# Altium schematic sheet Main_uC.SchDoc: Main microcontroller
size A3; Organization: Use Organization_Name in ProjParam; Address1: Eliot Ferragni; Address2: STI-MOBOTS; Address3: EPFL; Address4: CH-1015 LAUSANNE; DocumentNumber: 2; Revision: A; SheetNumber: 2; SheetTotal: 11; ApprovedBy: Init ApprovedBy in DocParam; CheckedBy: Init CheckedBy in DocParam; Author: Init Author in DocParam; CompanyName: Init CompanyName in DocParam; DrawnBy: Init DrawBy in DocParam; Engineer: Init Engineer in DocParam; Title2: Main microcontroller + user's buttons; DocumentName: Init DocumentName in DocParam; ProjectName: Init ProjectName in DocParam
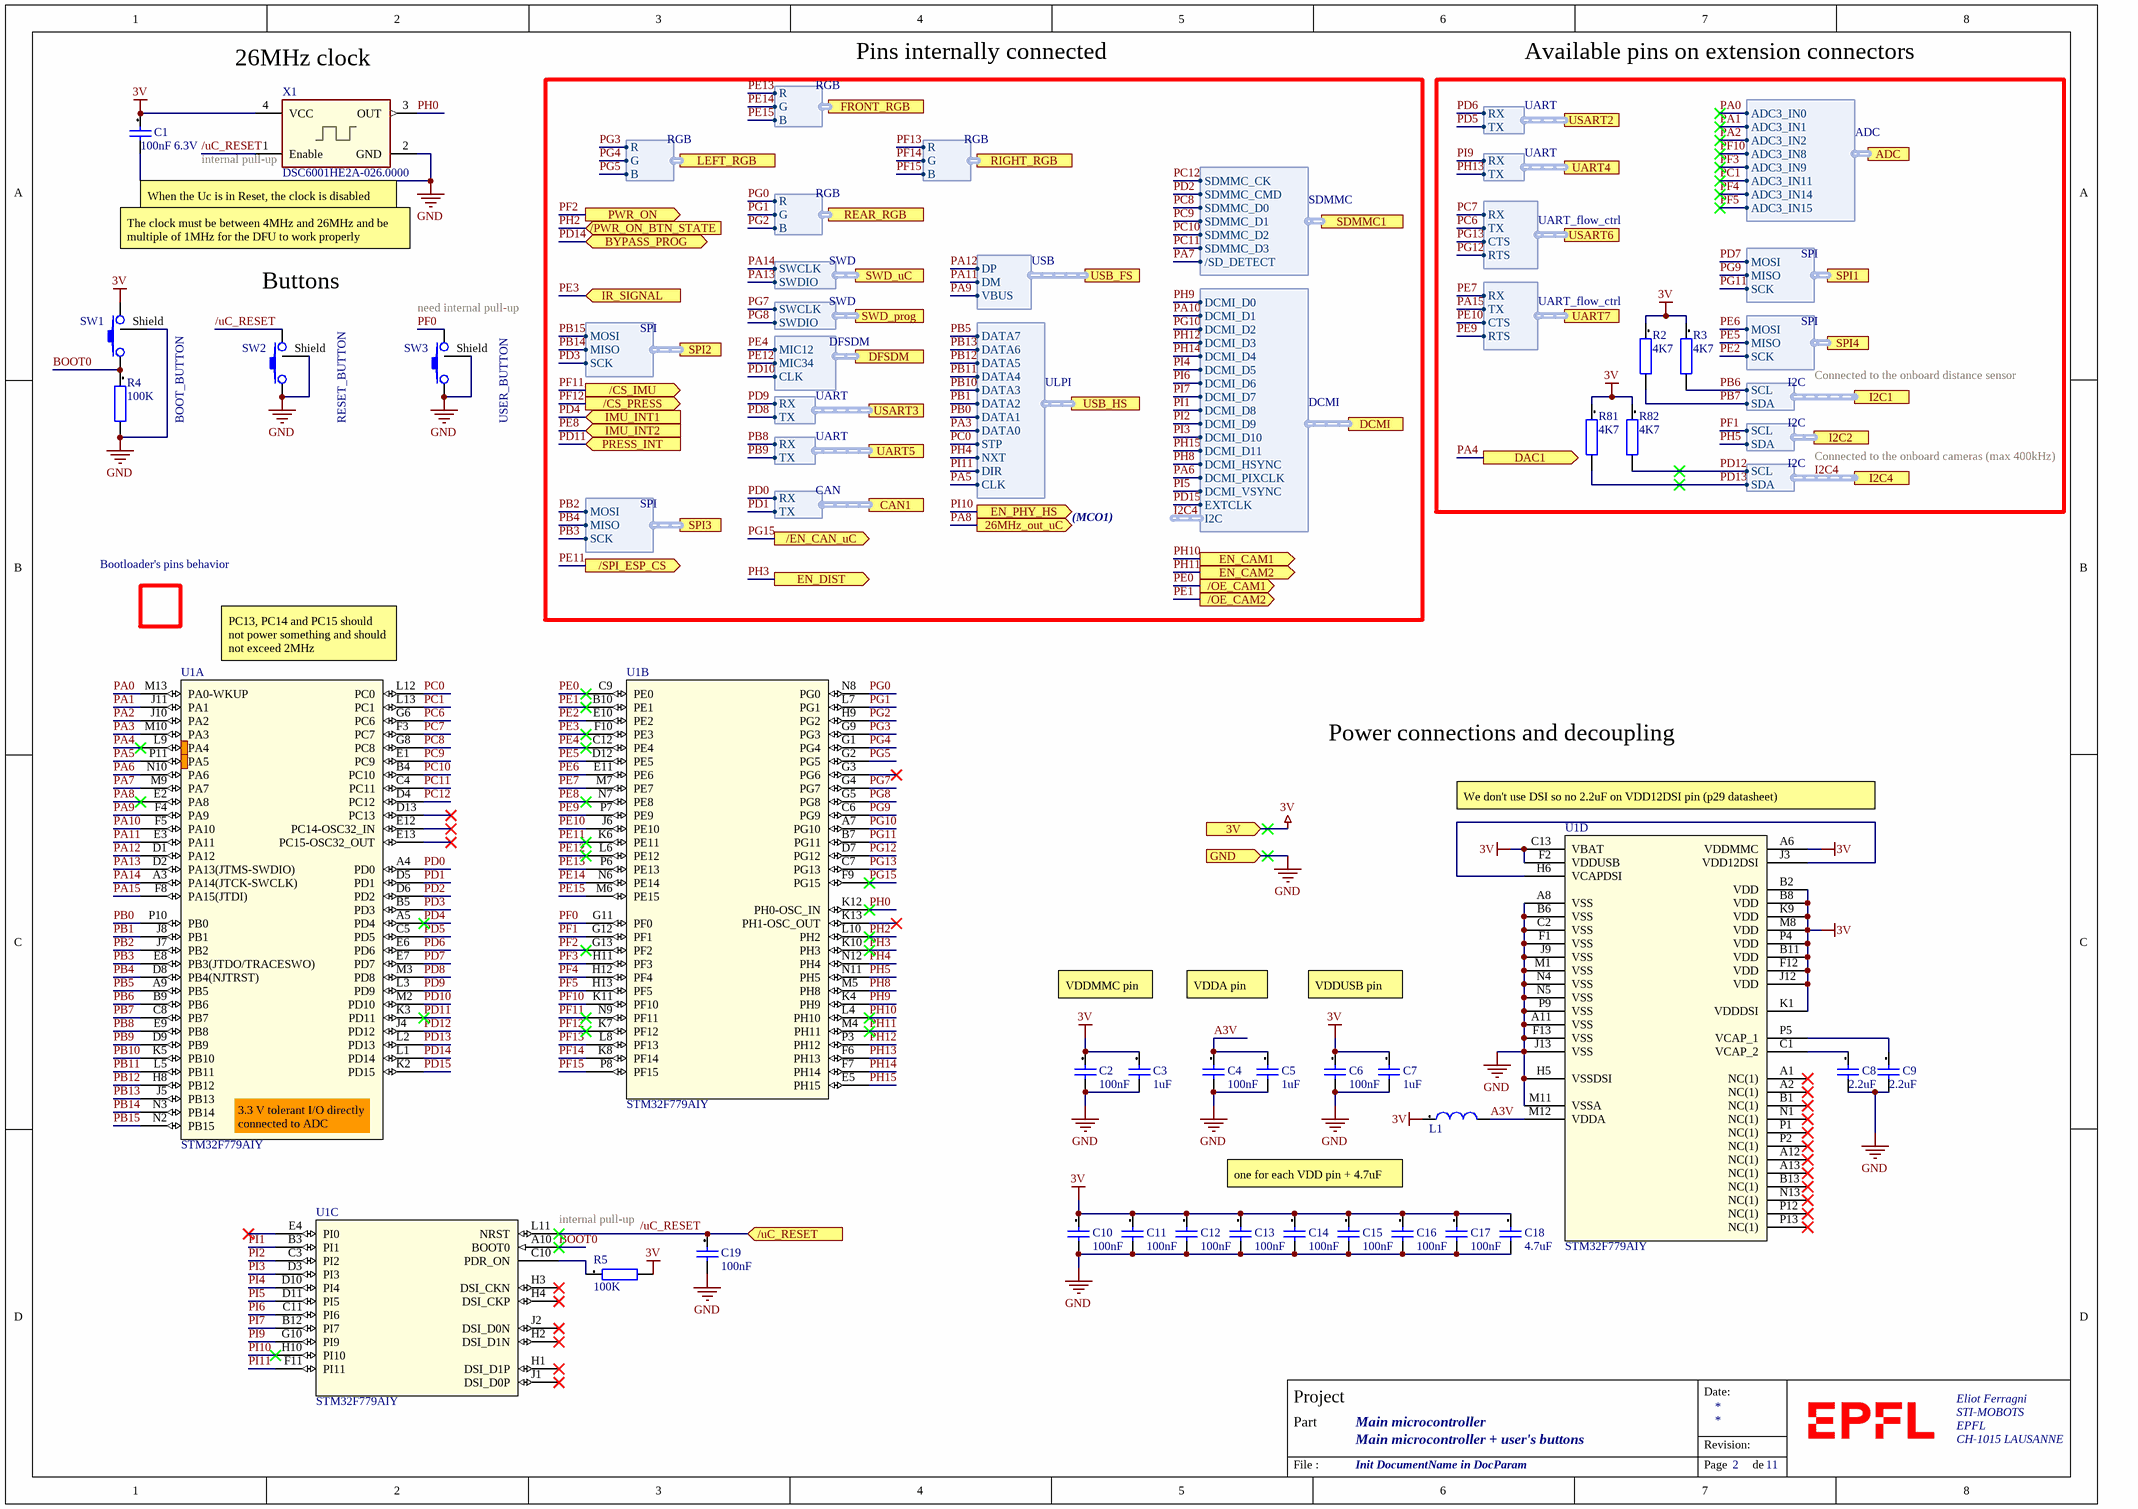
[diagram p0: Main_uC.SchDoc]

## Parts
C1  100nF 6.3V  [CAPC0201(0603)33_L]
C2  100nF  [CAPC0201(0603)33_L]
C3  1uF  [CAPC0201(0603)33_L]
C4  100nF  [CAPC0201(0603)33_L]
C5  1uF  [CAPC0201(0603)33_L]
C6  100nF  [CAPC0201(0603)33_L]
C7  1uF  [CAPC0201(0603)33_L]
C8  2.2uF  [CAPC0201(0603)33_L]
C9  2.2uF  [CAPC0201(0603)33_L]
C10  100nF  [CAPC0201(0603)33_L]
C11  100nF  [CAPC0201(0603)33_L]
C12  100nF  [CAPC0201(0603)33_L]
C13  100nF  [CAPC0201(0603)33_L]
C14  100nF  [CAPC0201(0603)33_L]
C15  100nF  [CAPC0201(0603)33_L]
C16  100nF  [CAPC0201(0603)33_L]
C17  100nF  [CAPC0201(0603)33_L]
C18  4.7uF  [CAPC0201(0603)33_L]
C19  100nF  [CAPC0201(0603)33_L]
L1  MMZ1005S601HT000  [0402 inductor]  (value not drawn)
R2  4K7  [RESC0201(0603)_L]
R3  4K7  [RESC0201(0603)_L]
R4  100K  [RESC0201(0603)_L]
R5  100K  [RESC0201(0603)_L]
R81  4K7  [RESC0201(0603)_L]
R82  4K7  [RESC0201(0603)_L]
SW1  button  [C&K_KMR2]  (value not drawn)
SW2  button  [C&K_KMR2]  (value not drawn)
SW3  button  [C&K_KMR2]  (value not drawn)
U1  STM32F779AIY  [WLCSP-180]  (parts A,B,C,D of 4)
X1  DSC6001HE2A-026.0000  [Oscillator 1.6x1.2mm VFLGA]

## Blocks framed on the sheet
Available pins on extension connectors: R2 R3 R81 R82

## Ports
3V (in), 26MHz_out_uC (out), /CS_IMU (out), /CS_PRESS (out), /EN_CAN_uC (out), /OE_CAM1 (out), /OE_CAM2 (out), /PWR_ON_BTN_STATE (in), /SPI_ESP_CS (out), /uC_RESET (in), ADC (harness ADC), BYPASS_PROG (bidir), CAN1 (harness CAN), DAC1 (out), DCMI (harness DCMI), DFSDM (harness DFSDM), EN_CAM1 (out), EN_CAM2 (out), EN_DIST (out), EN_PHY_HS (out), FRONT_RGB (harness RGB), GND (in), I2C1 (harness I2C), I2C2 (harness I2C), I2C4 (harness I2C), IMU_INT1 (in), IMU_INT2 (in), IR_SIGNAL (in), LEFT_RGB (harness RGB), PRESS_INT (in), PWR_ON (out), REAR_RGB (harness RGB), RIGHT_RGB (harness RGB), SDMMC1 (harness SDMMC), SPI1 (harness SPI), SPI2 (harness SPI), SPI3 (harness SPI), SPI4 (harness SPI), SWD_prog (harness SWD), SWD_uC (harness SWD), UART4 (harness UART), UART5 (harness UART), UART7 (harness UART_flow_ctrl), USART2 (harness UART), USART3 (harness UART), USART6 (harness UART_flow_ctrl), USB_FS (harness USB), USB_HS (harness ULPI)

## Harnesses
SWD: SWDIO, SWCLK
I2C: SDA, SCL
CAN: TX, RX
USB: DM, DP, VBUS
UART: RX, TX
RGB: R, G, B
DFSDM: MIC34, MIC12, CLK
DCMI: DCMI_D0, DCMI_D1, DCMI_D2, DCMI_D3, DCMI_D4, DCMI_D5, DCMI_D6, DCMI_D7, DCMI_D8, DCMI_D9, DCMI_D10, DCMI_D11, DCMI_HSYNC, DCMI_PIXCLK, DCMI_VSYNC, I2C, EXTCLK
SDMMC: SDMMC_CK, SDMMC_CMD, SDMMC_D0, SDMMC_D1, SDMMC_D2, SDMMC_D3, /SD_DETECT
SPI: MISO, MOSI, SCK
UART_flow_ctrl: RX, TX, CTS, RTS
ADC: ADC3_IN0, ADC3_IN1, ADC3_IN2, ADC3_IN8, ADC3_IN9, ADC3_IN11, ADC3_IN14, ADC3_IN15
ULPI: DATA7, DATA6, DATA5, DATA4, DATA3, DATA2, DATA1, DATA0, STP, NXT, DIR, CLK

## Nets
3V: C1.1 C2.1 C3.1 C6.1 C7.1 C10.1 C11.1 C12.1 C13.1 C14.1 C15.1 C16.1 C17.1 C18.1 L1.1 R2.1 R3.1 R5.2 R81.1 R82.1 SW1.2 U1.A6(VDDMMC) U1.B2(VDD) U1.B8(VDD) U1.B11(VDD) U1.C13(VBAT) U1.F2(VDDUSB) U1.F12(VDD) U1.J12(VDD) U1.K1(VDDDSI) U1.K9(VDD) U1.M8(VDD) U1.P4(VDD) X1.4(VCC) ; port 3V
GND: C1.2 C2.2 C3.2 C4.2 C5.2 C6.2 C7.2 C8.2 C9.2 C10.2 C11.2 C12.2 C13.2 C14.2 C15.2 C16.2 C17.2 C18.2 C19.2 R4.2 SW1.Shield SW2.1 SW2.Shield SW3.1 SW3.Shield U1.A8(VSS) U1.A11(VSS) U1.B6(VSS) U1.C2(VSS) U1.F1(VSS) U1.F13(VSS) U1.H5(VSSDSI) U1.J9(VSS) U1.J13(VSS) U1.M1(VSS) U1.M11(VSSA) U1.N4(VSS) U1.N5(VSS) U1.P9(VSS) X1.2(GND) ; port GND
/uC_RESET: C19.1 SW2.2 U1.L11(NRST) X1.1(Enable) ; port /uC_RESET
A3V: C4.1 C5.1 L1.2 U1.M12(VDDA)
BOOT0: R4.1 SW1.1 U1.A10(BOOT0)
PA0: U1.M13(PA0-WKUP) ; port ADC.ADC3_IN0
PA1: U1.J11(PA1) ; port ADC.ADC3_IN1
PA2: U1.J10(PA2) ; port ADC.ADC3_IN2
PA3: U1.M10(PA3) ; port USB_HS.DATA0
PA4: U1.L9(PA4) ; port DAC1
PA5: U1.P11(PA5) ; port USB_HS.CLK
PA6: U1.N10(PA6) ; port DCMI.DCMI_PIXCLK
PA7: U1.M9(PA7) ; port SDMMC1./SD_DETECT
PA8: U1.E2(PA8) ; port 26MHz_out_uC
PA9: U1.F4(PA9) ; port USB_FS.VBUS
PA10: U1.F5(PA10) ; port DCMI.DCMI_D1
PA11: U1.E3(PA11) ; port USB_FS.DM
PA12: U1.D1(PA12) ; port USB_FS.DP
PA13: U1.D2(PA13(JTMS-SWDIO)) ; port SWD_uC.SWDIO
PA14: U1.A3(PA14(JTCK-SWCLK)) ; port SWD_uC.SWCLK
PA15: U1.F8(PA15(JTDI)) ; port UART7.TX
PB0: U1.P10(PB0) ; port USB_HS.DATA1
PB1: U1.J8(PB1) ; port USB_HS.DATA2
PB2: U1.J7(PB2) ; port SPI3.MOSI
PB3: U1.E8(PB3(JTDO/TRACESWO)) ; port SPI3.SCK
PB4: U1.D8(PB4(NJTRST)) ; port SPI3.MISO
PB5: U1.A9(PB5) ; port USB_HS.DATA7
PB6: R3.2 U1.B9(PB6) ; port I2C1.SCL
PB7: R2.2 U1.C8(PB7) ; port I2C1.SDA
PB8: U1.E9(PB8) ; port UART5.RX
PB9: U1.D9(PB9) ; port UART5.TX
PB10: U1.K5(PB10) ; port USB_HS.DATA3
PB11: U1.L5(PB11) ; port USB_HS.DATA4
PB12: U1.H8(PB12) ; port USB_HS.DATA5
PB13: U1.J5(PB13) ; port USB_HS.DATA6
PB14: U1.N3(PB14) ; port SPI2.MISO
PB15: U1.N2(PB15) ; port SPI2.MOSI
PC0: U1.L12(PC0) ; port USB_HS.STP
PC1: U1.L13(PC1) ; port ADC.ADC3_IN11
PC6: U1.G6(PC6) ; port USART6.TX
PC7: U1.F3(PC7) ; port USART6.RX
PC8: U1.G8(PC8) ; port SDMMC1.SDMMC_D0
PC9: U1.E1(PC9) ; port SDMMC1.SDMMC_D1
PC10: U1.B4(PC10) ; port SDMMC1.SDMMC_D2
PC11: U1.C4(PC11) ; port SDMMC1.SDMMC_D3
PC12: U1.D4(PC12) ; port SDMMC1.SDMMC_CK
PD0: U1.A4(PD0) ; port CAN1.RX
PD1: U1.D5(PD1) ; port CAN1.TX
PD2: U1.D6(PD2) ; port SDMMC1.SDMMC_CMD
PD3: U1.B5(PD3) ; port SPI2.SCK
PD4: U1.A5(PD4) ; port IMU_INT1
PD5: U1.C5(PD5) ; port USART2.TX
PD6: U1.E6(PD6) ; port USART2.RX
PD7: U1.E7(PD7) ; port SPI1.MOSI
PD8: U1.M3(PD8) ; port USART3.TX
PD9: U1.L3(PD9) ; port USART3.RX
PD10: U1.M2(PD10) ; port DFSDM.CLK
PD11: U1.K3(PD11) ; port PRESS_INT
PD12: R82.2 U1.J4(PD12) ; port I2C4.SCL  [project net I2C4.SCL]
PD13: R81.2 U1.L2(PD13) ; port I2C4.SDA  [project net I2C4.SDA]
PD14: U1.L1(PD14) ; port BYPASS_PROG
PD15: U1.K2(PD15) ; port DCMI.EXTCLK
PE0: U1.C9(PE0) ; port /OE_CAM1
PE1: U1.B10(PE1) ; port /OE_CAM2
PE2: U1.E10(PE2) ; port SPI4.SCK
PE3: U1.F10(PE3) ; port IR_SIGNAL
PE4: U1.C12(PE4) ; port DFSDM.MIC12
PE5: U1.D12(PE5) ; port SPI4.MISO
PE6: U1.E11(PE6) ; port SPI4.MOSI
PE7: U1.M7(PE7) ; port UART7.RX
PE8: U1.N7(PE8) ; port IMU_INT2
PE9: U1.P7(PE9) ; port UART7.RTS
PE10: U1.J6(PE10) ; port UART7.CTS
PE11: U1.K6(PE11) ; port /SPI_ESP_CS
PE12: U1.L6(PE12) ; port DFSDM.MIC34
PE13: U1.P6(PE13) ; port FRONT_RGB.R
PE14: U1.N6(PE14) ; port FRONT_RGB.G
PE15: U1.M6(PE15) ; port FRONT_RGB.B
PF0: SW3.2 U1.G11(PF0)
PF1: U1.G12(PF1) ; port I2C2.SCL
PF2: U1.G13(PF2) ; port PWR_ON
PF3: U1.H11(PF3) ; port ADC.ADC3_IN9
PF4: U1.H12(PF4) ; port ADC.ADC3_IN14
PF5: U1.H13(PF5) ; port ADC.ADC3_IN15
PF10: U1.K11(PF10) ; port ADC.ADC3_IN8
PF11: U1.N9(PF11) ; port /CS_IMU
PF12: U1.K7(PF12) ; port /CS_PRESS
PF13: U1.L8(PF13) ; port RIGHT_RGB.R
PF14: U1.K8(PF14) ; port RIGHT_RGB.G
PF15: U1.P8(PF15) ; port RIGHT_RGB.B
PG0: U1.N8(PG0) ; port REAR_RGB.R
PG1: U1.L7(PG1) ; port REAR_RGB.G
PG2: U1.H9(PG2) ; port REAR_RGB.B
PG3: U1.G9(PG3) ; port LEFT_RGB.R
PG4: U1.G1(PG4) ; port LEFT_RGB.G
PG5: U1.G2(PG5) ; port LEFT_RGB.B
PG7: U1.G4(PG7) ; port SWD_prog.SWCLK
PG8: U1.G5(PG8) ; port SWD_prog.SWDIO
PG9: U1.C6(PG9) ; port SPI1.MISO
PG10: U1.A7(PG10) ; port DCMI.DCMI_D2
PG11: U1.B7(PG11) ; port SPI1.SCK
PG12: U1.D7(PG12) ; port USART6.RTS
PG13: U1.C7(PG13) ; port USART6.CTS
PG15: U1.F9(PG15) ; port /EN_CAN_uC
PH0: U1.K12(PH0-OSC_IN) X1.3(OUT)
PH2: U1.L10(PH2) ; port /PWR_ON_BTN_STATE
PH3: U1.K10(PH3) ; port EN_DIST
PH4: U1.N12(PH4) ; port USB_HS.NXT
PH5: U1.N11(PH5) ; port I2C2.SDA
PH8: U1.M5(PH8) ; port DCMI.DCMI_HSYNC
PH9: U1.K4(PH9) ; port DCMI.DCMI_D0
PH10: U1.L4(PH10) ; port EN_CAM1
PH11: U1.M4(PH11) ; port EN_CAM2
PH12: U1.P3(PH12) ; port DCMI.DCMI_D3
PH13: U1.F6(PH13) ; port UART4.TX
PH14: U1.F7(PH14) ; port DCMI.DCMI_D4
PH15: U1.E5(PH15) ; port DCMI.DCMI_D11
PI1: U1.B3(PI1) ; port DCMI.DCMI_D8
PI2: U1.C3(PI2) ; port DCMI.DCMI_D9
PI3: U1.D3(PI3) ; port DCMI.DCMI_D10
PI4: U1.D10(PI4) ; port DCMI.DCMI_D5
PI5: U1.D11(PI5) ; port DCMI.DCMI_VSYNC
PI6: U1.C11(PI6) ; port DCMI.DCMI_D6
PI7: U1.B12(PI7) ; port DCMI.DCMI_D7
PI9: U1.G10(PI9) ; port UART4.RX
PI10: U1.H10(PI10) ; port EN_PHY_HS
PI11: U1.F11(PI11) ; port USB_HS.DIR
NetC8_1: C8.1 U1.C1(VCAP_2)
NetC9_1: C9.1 U1.P5(VCAP_1)
NetR5_1: R5.1 U1.C10(PDR_ON)
NetU1_H6: U1.H6(VCAPDSI) U1.J3(VDD12DSI)

Not connected (* = marked no-connect by the designer): U1 A1(NC(1))* A2(NC(1))* A12(NC(1))* A13(NC(1))* B1(NC(1))* B13(NC(1))* D13(PC13)* E4(PI0)* E12(PC14-OSC32_IN)* E13(PC15-OSC32_OUT)* G3(PG6)* H1(DSI_D1P)* H2(DSI_D1N)* H3(DSI_CKN)* H4(DSI_CKP)* J1(DSI_D0P)* J2(DSI_D0N)* K13(PH1-OSC_OUT)* N1(NC(1))* N13(NC(1))* P1(NC(1))* P2(NC(1))* P12(NC(1))* P13(NC(1))*

## Buses and harness runs
harness I2C4 = port I2C4

## Notes on the sheet
- (near X1) 26MHz clock
- Pins internally connected
- (near X1) internal pull-up
- The clock must be between 4MHz and 26MHz and be multiple of 1MHz for the DFU to work properly
- When the Uc is in Reset, the clock is disabled
- (near SW2) Buttons
- (near SW3) need internal pull-up
- Connected to the onboard distance sensor
- BOOT_BUTTON
- RESET_BUTTON
- USER_BUTTON
- Connected to the onboard cameras (max 400kHz)
- Bootloader's pins behavior
- (MCO1)
- (near U1) PC13, PC14 and PC15 should not power something and should not exceed 2MHz
- Power connections and decoupling
- (near U1) We don't use DSI so no 2.2uF on VDD12DSI pin (p29 datasheet)
- VDDMMC pin
- VDDA pin
- VDDUSB pin
- (near U1) Bootloader's pins behavior :
  USART1 :
  PA10 (RX) set as input 		-> connected to DCMI_D1						=> OK
  PA9 (TX) set as output high		-> connected to VBUS_DEVICES					=> problem if VBUS_DEVICES is low -> Serial Resistance
  USART3:
  PB11 (RX) set as input		-> connected to ULPI_D4						=> OK because the HS Phy is turned OFF if we are in the BOOTLOADER (pins are in Tri-State)
  PB10 (TX) set as output high		-> connected to ULPI_D3						=> OK because the HS Phy is turned OFF if we are in the BOOTLOADER (pins are in Tri-State)
  PC11 (RX) set as input		-> connected to SDMMC_D3						=> OK (sd card can connect it to VCC with a 50k resistor)
  PC10 (TX) set as output high		-> connected to SDMMC_D2						=> OK (sd card is input floating unless a SET_BUS_WIDTH is received)
  CAN2 (slave):
  PB5 (RX) set as input			-> connected to ULPI_D7						=> OK
  PB13 (TX) set as output high		-> connected to ULPI_D6						=> OK because the HS Phy is turned OFF if we are in the BOOTLOADER (pins are in Tri-State)
  I2C1 (slave):
  PB6 (SCL) set as open-drain		-> connected to I2C1 SCL						=> OK
  PB9 (SDA) set as open-drain		-> connected to UART5 TX						=> OK
  I2C2 (slave):
  PF1 (SCL) set as open-drain		-> connected to I2C2 SCL						=> OK
  PF0 (SDA) set as open-drain		-> connected to USER_BUTTON					=> OK
  I2C3 (slave):
  PA8 (SCL) set as open-drain		-> connected to REFCLK of HS Phy					=> OK
  PC9 (SDA) set as open-drain		-> connected to SDMMC_D1						=> OK
  SPI1 (slave):
  PA7 (MOSI) set as input pull-down	-> connected to SDMMC_DET						=> OK
  PA6 (MISO) set as output pull-down	-> connected to DCMI_PIXCLK						=> OK because camera is off if we are in BOOTLOADER
  PA5 (SCK) set as input pull-down	-> connected to ULPI_CK						=> OK (pull-down is around 40k)
  PA4 (NSS) set as input pull-up		-> connected to DAC_OUT1						=> OK
  SPI2 (slave):
  PI3 (MOSI) set as input pull-down	-> connected to DCMI_D10						=> OK (pull-down is around 40k)
  PI2 (MISO) set as output pull-down	-> connected to DCMI_D9						=> OK because camera is off if we are in BOOTLOADER
  PI1 (SCK) set as input pull-down		-> connected to DCMI_D8						=> OK (pull-down is around 40k)
  PI0 (NSS) set as input pull-up		-> connected to DCMI_D13						=> OK (pull-up is around 40k)
  SPI4 (slave):
  PE14 (MOSI) set as input pull-down	-> connected FRONT_RGB_G						=> OK
  PE13 (MISO) set as output pull-down	-> connected FRONT_RGB_R						=> OK
  PE12 (SCK) set as input pull-down	-> connected to MIC34						=> OK because the microphones won't send anything if not clocked
  PE11 (NSS) set as input pull-up		-> connected to /SPI_ESP_CS						=> OK
  USB (DFU):
  PA11 (DM)			-> connected to DM of the USB hub					=> OK
  PA12 (DP) (no pull-up needed)		-> connected to DP of the USB hub					=> OK
- one for each VDD pin + 4.7uF
- internal pull-up
- Date:
- Project
- Part
- Revision:
- File :
- Page
- de
- (in symbol STM32F77XAXY, part A) 3.3 V tolerant I/O directly connected to ADC

## Library data of the parts
C1-C19 = TBD Capacitor[[/\]]0201[[/\]]1: Capacitor 0201; Preference: 1; Currentie: CHF; Type: SMD; Note: To buy by assembler; Size: 0201; Footprint Acort: 0201; ROHS: True; DateLastUpdate: 2018-10-19 / 8:59:52 AM; Manufacturer: -; Manufacturer part number: -; Package / Case: Capacitor 0201
L1 = MMZ1005S601HT000: FERRITE BEAD 600 OHM 0402 1LN; Manufacturer: TDK; Type: SMD; Note: To buy by assembler; Supplier 1: Digi-Key; Stock 1: 33440; Pricing 1: 1 = 0,10000, 10 = 0,07300, 25 = 0,06600, 50 = 0,05940, 100 = 0,04360, 250 = 0,03168, 500 = 0,02904, 1000 = 0,02508, 5000 = 0,01980 (USD); RoHS: No; ComponentLink1URL: https://product.tdk.com/info/en/catalog/datasheets/beads_commercial_signal_mmz1005-h_en.pdf?src-supplier=Digi-Key; ComponentLink1Description: https://product.tdk.com/info/en/catalog/datasheets/beads_commercial_signal_mmz1005-h_en.pdf?src-supplier=Digi-Key; Supplier Part Number 1: 445-175172-1-ND; Manufacturer Part Number: MMZ1005S601HT000; Package / Case: Ferrite bead 0402
R2-R5 R81 R82 = TBD[[/\]]0201[[/\]]1: Resistor 0201; Preference: 1; Currentie: CHF; Note: To buy by assembler; Size: 0201; Footprint Acort: 0201; ROHS: True; DateLastUpdate: 2018-10-19 / 9:06:49 AM; Type: SMD; Manufacturer: -; Manufacturer part number: -; Package / Case: Resistor 0201
SW1-SW3 = C&K KMR2: KMR221GLFS; Manufacturer: C&K; Manufacturer Nr: 7-188275-6; Preference: 1; Currentie: CHF; Quant_1: 10; Quant_2: 900; Circuit: SPST-NO; Switch Function: Off-Mom; Contact Rating @ Voltage: 0.05A @ 32VDC; Actuator Type: Standard; Actuator Height off PCB, from Pins: 1.90mm; Actuator Orientation: Top Actuated; Outline: 4.60mm x 2.80mm; Illumination: Non-Illuminated; Operating Force: 200gf; Switch Travel: 0.25mm; Mechanical Life: 200,000 Cycles; Note: To buy by assembler; Footprint Acort: ToDefine; ComponentLink1Description: Datasheet; ComponentLink1URL: http://ecommas.tycoelectronics.com/commerce/DocumentDelivery/DDEController?Action=showdoc&DocId=Customer+Drawing%7F188275%7FR%7Fpdf%7FEnglish%7FC_188275_R.pdf; Supplier: Farnell; Supplier Nr: 1056234; ComponentLink2Description: Farnell link; ComponentLink2URL: http://fr.farnell.com/jsp/displayProduct.jsp?sku=1056234; ROHS: True; Type: SMD; Orientation: Vertical; DateLastUpdate: 2007-12-04 / 09:15:57; Price_1: 1,1; Price_2: 0,924; Supplier 1: Digi-Key; Manufacturer Part Number: KMR221GLFS; Category: Switches; Stock 1: 20549; Pricing 1: 1=0.51, 10=0.493, 25=0.484, 50=0.4656, 100=0.4017, 250=0.3652, 500=0.34694, 1000=0.2739 (USD); Packaging: Cut Tape (CT); Mounting Type: Surface Mount; Termination Style: Gull Wing; Illumination Voltage (Nominal): -; Illumination Type, Color: -; Ingress Protection: -; Features: Grounding Pin; Actuator Material: -; Operating Temperature: -40°C ~ 85°C; ComponentLink3URL: http://www.ck-components.com/index.php?module=media&action=Display&cmpref=14414&lang=en&width=&height=&format=&alt=; ComponentLink3Description: http://www.ck-components.com/index.php?module=media&action=Display&cmpref=14414&lang=en&width=&height=&format=&alt=; Supplier Part Number 1: 401-1427-1-ND; Package / Case: SMD Button
U1 = STM32F77XAXY: High Performance 32bits microcontroler; Vendor: STMicroelectronics; C: Copyright (C) 2016 Accelerated Designs. All rights reserved; Note: To buy by assembler; Manufacturer_Part_Number: stm32f779aiy; Copyright: Copyright (C) 2016 Accelerated Designs. All rights reserved; RefDes: RefDes; Type: SMD; Value: Value; Manufacturer: STMicroelectronics; Manufacturer part number: STM32F779AIY; Package / Case: WLCSP-180
X1 = DSC6001HE2A-026.0000: 26MHz LVCMOS MEMS (Silicon) Oscillator  1.71 V ~ 3.63 V Enable/Disable; Manufacturer: Microchip; Note: To buy by assembler; Supplier 1: Digi-Key; Stock 1: 797; Pricing 1: 1 = 1,07000, 25 = 0,89600, 100 = 0,81370 (USD); RoHS: No; Supplier Part Number 1: DSC6001HE2A-026.0000-ND; Manufacturer Part Number: DSC6001HE2A-026.0000; Type: SMD; Package / Case: VFLGA-4